# EAGLE design speed_control (EAGLE 9.5.2)
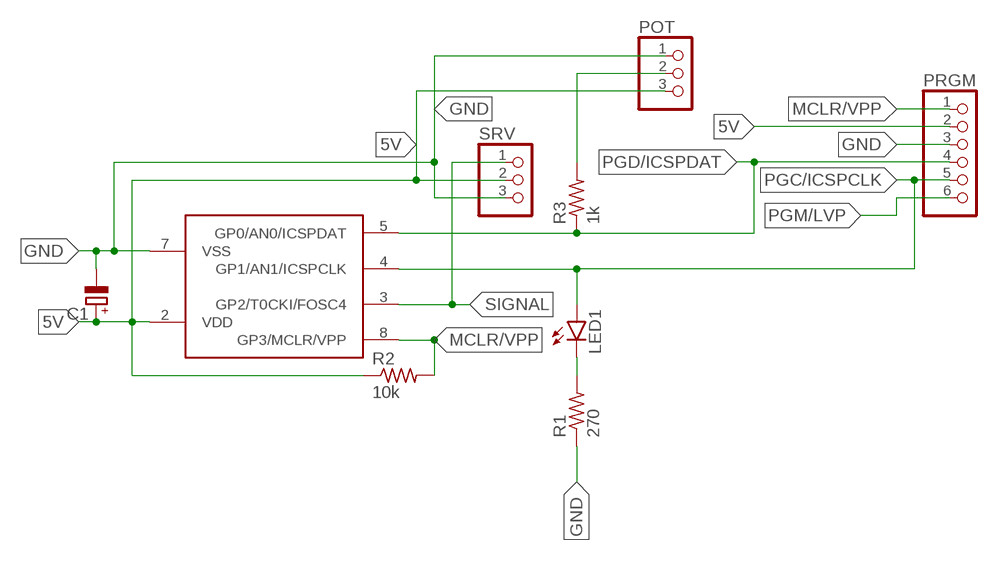
[diagram p0: schematic, sheet 1]

## Parts
C1  CPOL-EUE3.5-8  [E3,5-8]
LED1  LED3MM  [LED3MM]
POT  PINHD-1X3  [1X03]
PRGM  PINHD-1X6  [1X06]
R1  270  R-US_0207/10  [0207/10]
R2  10k  R-US_0207/10  [0207/10]
R3  1k  R-US_0207/10  [0207/10]
SRV  PINHD-1X3/90  [1X03/90]
U$1  PIC10F222PIC10F222  [DIP762W53P254L955H330Q8B]

## Nets
5V: C1.+ POT.3 PRGM.2 R2.1 SRV.2 U$1.2(VDD)
GND: C1.- POT.1 PRGM.3 R1.1 SRV.3 U$1.7(VSS)
MCLR/VPP: PRGM.1 R2.2 U$1.8(GP3/MCLR/VPP)
N$1: POT.2 R3.2
N$2: LED1.K(C) R1.2
PGC/ICSPCLK: LED1.A PRGM.5 U$1.4(GP1/AN1/ICSPCLK)
PGD/ICSPDAT: PRGM.4 R3.1 U$1.5(GP0/AN0/ICSPDAT)
PGM/LVP: PRGM.6
SIGNAL: SRV.1 U$1.3(GP2/T0CKI/FOSC4)

## Library data of the parts
C1 = rcl:CPOL-EU: POLARIZED CAPACITOR, European symbol; SPICEPREFIX: C
LED1 = led:LED: LED OSRAM: - CHIPLED LG R971, LG N971, LY N971, LG Q971, LY Q971, LO R971, LY R971 LH N974, LH R974 LS Q976, LO Q976, LY Q976 LO Q996 - Hyper CHIPLED LW Q18S LB Q993, LB Q99A, LB R99A - SideLED LS A670, LO A670, LY A670, LG A670, LP A670 LB A673, LV A673, LT A673, LW A673 LH A674 LY A675 LS A676, LA A676, LO A676, LY A676, LW A676 LS A679, LY A679, LG A679 - Hyper Micro SIDELED® LS Y876, LA Y876, LO Y876, LY Y876 LT Y87S - SmartLED LW L88C, LW L88S LB L89C, LB L89S, LG L890 LS L89K, LO L89K, LY L89K LS L896, LA L896, LO L896, LY L896 - TOPLED LS T670, LO T670, LY T670, LG T670, LP T670 LSG T670, LSP T670, LSY T670, LOP T670, LYG T670 LG T671, LOG T671, LSG T671 LB T673, LV T673, LT T673, LW T673 LH T674 LS T676, LA T676, LO T676, LY T676, LB T676, LH T676, LSB T676, LW T676 LB T67C, LV T67C, LT T67C, LS T67K, LO T67K, LY T67K, LW E67C LS E67B, LA E67B, LO E67B, LY E67B, LB E67C, LV E67C, LT E67C LW T67C LS T679, LY T679, LG T679 LS T770, LO T770, LY T770, LG T770, LP T770 LB T773, LV T773, LT T773, LW T773 LH T774 LS E675, LA E675, LY E675, LS T675 LS T776, LA T776, LO T776, LY T776, LB T776 LHGB T686 LT T68C, LB T68C - Hyper Mini TOPLED® LB M676 - Mini TOPLED Santana® LG M470 LS M47K, LO M47K, LY M47K Source: http://www.osram.convergy.de LUXEON: - LUMILED® LXK2-PW12-R00, LXK2-PW12-S00, LXK2-PW14-U00, LXK2-PW14-V00 LXK2-PM12-R00, LXK2-PM12-S00, LXK2-PM14-U00 LXK2-PE12-Q00, LXK2-PE12-R00, LXK2-PE12-S00, LXK2-PE14-T00, LXK2-PE14-U00 LXK2-PB12-K00, LXK2-PB12-L00, LXK2-PB12-M00, LXK2-PB14-N00, LXK2-PB14-P00, LXK2-PB14-Q00 LXK2-PR12-L00, LXK2-PR12-M00, LXK2-PR14-Q00, LXK2-PR14-R00 LXK2-PD12-Q00, LXK2-PD12-R00, LXK2-PD12-S00 LXK2-PH12-R00, LXK2-PH12-S00 LXK2-PL12-P00, LXK2-PL12-Q00, LXK2-PL12-R00 Source: www.luxeon.com KINGBRIGHT: KA-3528ASYC Source: www.kingbright.com
POT SRV = pinhead:PINHD-1X3: PIN HEADER
PRGM = pinhead:PINHD-1X6: PIN HEADER
R1-R3 = rcl:R-US_: RESISTOR, American symbol; SPICEPREFIX: R
U$1 = PIC10F222:PIC10F222

## Board
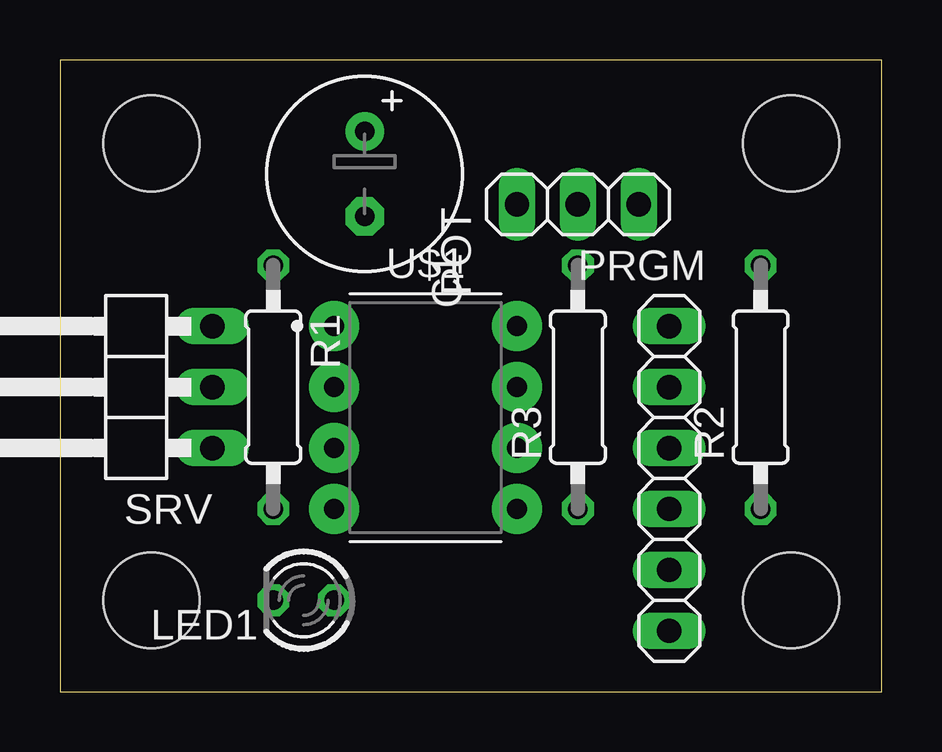
[diagram p1: board, top side]
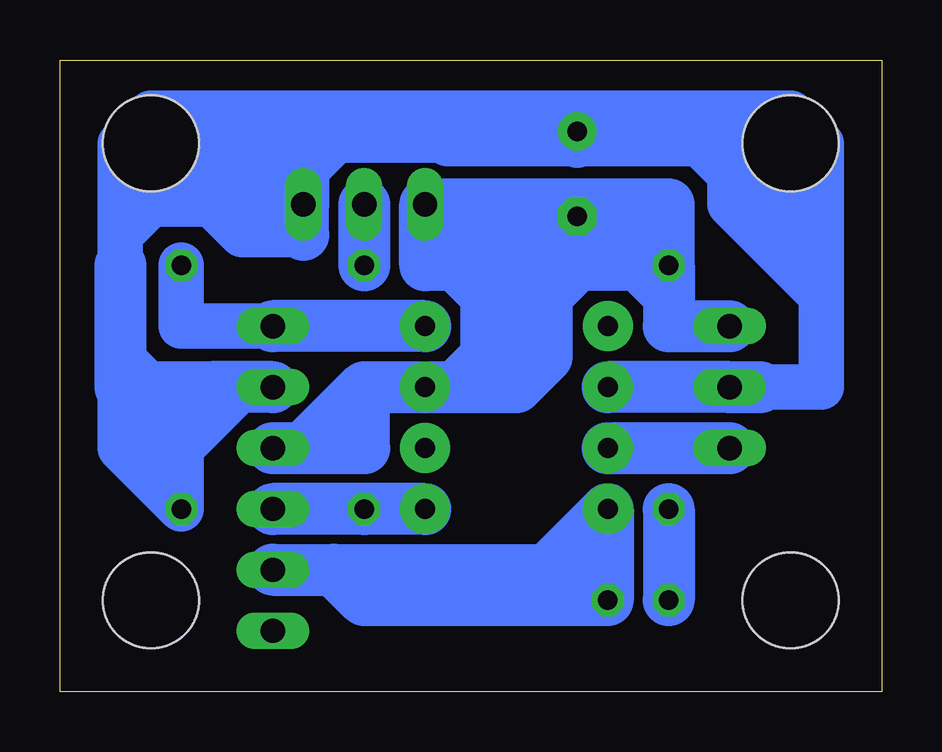
[diagram p2: board, bottom side, seen from below]

Size 34.27 x 26.34 mm. Coordinates in mm from the lower left corner, seen from the top.
Outline: 0,0 34.27,0 34.27,26.34 0,26.34 0,0
Copper layers (1*16): Top 0.035mm / dielectric 1.5mm / Bottom 0.035mm
Design rules "default *": minimum track width 6mil, minimum drill 0.35mm, track to track 0.2mm, track to pad 0.2mm, pad to pad 0.2mm, via to via 0.2mm, smd to smd 6mil, copper to edge 6mil, drill to drill 6mil, minimum pad ring 10mil, minimum via ring 8mil, stop-mask expansion 4mil, vias tented up to drill 0mil, thermal gap 10mil
Holes 4 mm at 3.81,3.81 30.48,3.81 3.81,22.86 30.48,22.86

### Footprints (pad centres in the part's own frame; a part is rotated, then mirrored left to right if it is on the bottom)
E3,5-8 = drill 0.813 pad 1.6: + -1.778,0 | drill 0.813 pad 1.6 octagon: - 1.778,0
LED3MM = drill 0.813 octagon: A -1.27,0; K 1.27,0
1X03 = drill 1.016 long: 1 -2.54,0; 2 0,0; 3 2.54,0
1X06 = drill 1.016 long: 1 -6.35,0; 2 -3.81,0; 3 -1.27,0; 4 1.27,0; 5 3.81,0; 6 6.35,0
0207/10 = drill 0.813 octagon: 1 -5.08,0; 2 5.08,0
1X03/90 = drill 1.016 long: 1 -2.54,-3.81; 2 0,-3.81; 3 2.54,-3.81
DIP762W53P254L955H330Q8B = drill 0.835 pad 2.088: 1 -3.81,3.81; 2 -3.81,1.27; 3 -3.81,-1.27; 4 -3.81,-3.81; 5 3.81,-3.81; 6 3.81,-1.27; 7 3.81,1.27; 8 3.81,3.81

### Placement (x,y rotation side)
C1  12.7,21.59 270 top
LED1  10.16,3.81 180 top
POT  21.59,20.32 0 top
PRGM  25.4,8.89 270 top
R1  8.89,12.7 270 top
R2  29.21,12.7 90 top
R3  21.59,12.7 90 top
SRV  2.54,12.7 90 top
U$1  15.24,11.43 0 top

### Tracks (layer width: path | path; a pad name or v marks a point on that pad's centre or on a via)
5V
  Bottom 1.905: 29.21,10.16 R2.1 31.75,10.16 31.75,12.7 29.21,10.16 | 29.21,10.16 29.21,11.43 | 29.21,11.43 29.21,12.7 30.48,12.7 31.75,13.97 | C1.+ 12.19,22.86 | 2.54,16.51 2.54,12.7 5.08,12.7 | 7.62,22.86 12.19,22.86 | 7.62,22.86 6.35,22.86 | 2.54,16.51 6.35,20.32 | 6.35,20.32 6.35,21.59 | 6.35,21.59 6.35,22.86 | 6.35,22.86 2.54,22.86 | 2.54,22.86 2.54,21.59 | 2.54,21.59 2.54,20.32 | 2.54,20.32 2.54,19.05 | 2.54,19.05 2.54,16.51 | 2.54,21.59 6.35,21.59 | 2.54,20.32 6.35,20.32 | 2.54,19.05 3.81,19.05 | 7.62,22.86 6.35,21.59 | 24.13,24.13 3.81,24.13 2.54,22.86 | 24.13,24.13 25.4,22.86 25.4,20.32 | 25.4,20.32 25.4,19.05 | 24.13,19.05 25.4,19.05 | 24.13,24.13 26.67,24.13 | 26.67,24.13 27.94,24.13 | 27.94,24.13 29.21,24.13 | 29.21,24.13 30.48,24.13 | 30.48,24.13 31.75,22.86 31.75,20.32 | 31.75,20.32 31.75,19.05 | 31.75,19.05 31.75,17.78 | 25.4,20.32 27.94,20.32 | 27.94,20.32 29.21,20.32 | 29.21,20.32 30.48,20.32 | 30.48,20.32 31.75,20.32 | 26.67,24.13 26.67,21.59 | 27.94,24.13 27.94,20.32 | 29.21,24.13 29.21,20.32 | 30.48,20.32 30.48,24.13 | 25.4,19.05 26.67,19.05 27.94,20.32 | 31.75,19.05 30.48,20.32 | 27.94,12.7 29.21,11.43 | 29.21,10.16 26.67,12.7 PRGM.2 | 12.19,22.86 18.12,22.86 18.26,23 22.78,23 22.86,23.08
  Bottom 2.032: C1.+ 12.7,22.86
  Bottom 2.159: 31.75,17.78 31.75,13.97 31.75,12.7 29.21,12.7 27.94,12.7 PRGM.2 | 5.08,12.7 SRV.2 U$1.2 | 24.13,19.05 POT.3 24.13,21.81 22.86,23.08
GND
  Bottom 2.032: C1.- 11.94,19.81 11.43,20.32
  Bottom 2.159: PRGM.3 24.13,10.16 | 21.59,12.7 U$1.7 17.78,12.7 | 17.78,12.7 16.51,12.7 | 16.51,12.7 15.24,12.7 | 15.24,12.7 15.24,17.78 | 15.24,20.32 15.24,17.78 | 15.24,20.32 11.43,20.32 8.89,20.32 | 15.24,20.32 POT.1 19.05,19.05 | R1.1 8.89,20.32 | R1.1 8.89,16.51 | 8.89,16.51 8.89,15.24 SRV.3 | R1.1 10.16,17.78 | 10.16,17.78 12.7,17.78 | 12.7,17.78 15.24,17.78 | 15.24,17.78 17.78,17.78 | 17.78,17.78 19.05,17.78 19.05,19.05 | 8.89,20.32 10.16,19.05 19.05,19.05 | 21.59,12.7 24.13,10.16 | 24.13,10.16 21.59,10.16 21.59,12.7 | 16.51,13.97 16.51,16.51 17.78,17.78 | 16.51,13.97 16.51,12.7 | 15.24,12.7 13.97,13.97 13.97,16.51 12.7,17.78 | 10.16,17.78 8.89,16.51 | 17.78,12.7 16.51,13.97
MCLR/VPP
  Bottom 1.905: PRGM.1 29.21,15.24 R2.2
  Bottom 2.159: U$1.8 PRGM.1
N$1
  Bottom 2.159: POT.2 R3.2
N$2
  Bottom 2.159: R1.2 LED1.K
PGC/ICSPCLK
  Bottom 2.159: 11.43,5.08 U$1.4 13.97,5.08 | 11.43,5.08 LED1.A 21.59,3.81 22.86,5.08 | PRGM.5 22.86,5.08 | 22.86,5.08 13.97,5.08 | 13.97,5.08 11.43,5.08
PGD/ICSPDAT
  Bottom 2.159: U$1.5 R3.1 PRGM.4
SIGNAL
  Bottom 2.159: U$1.3 SRV.1